# EAGLE design iBUG_4260_V1.1 (EAGLE 9.6.2)
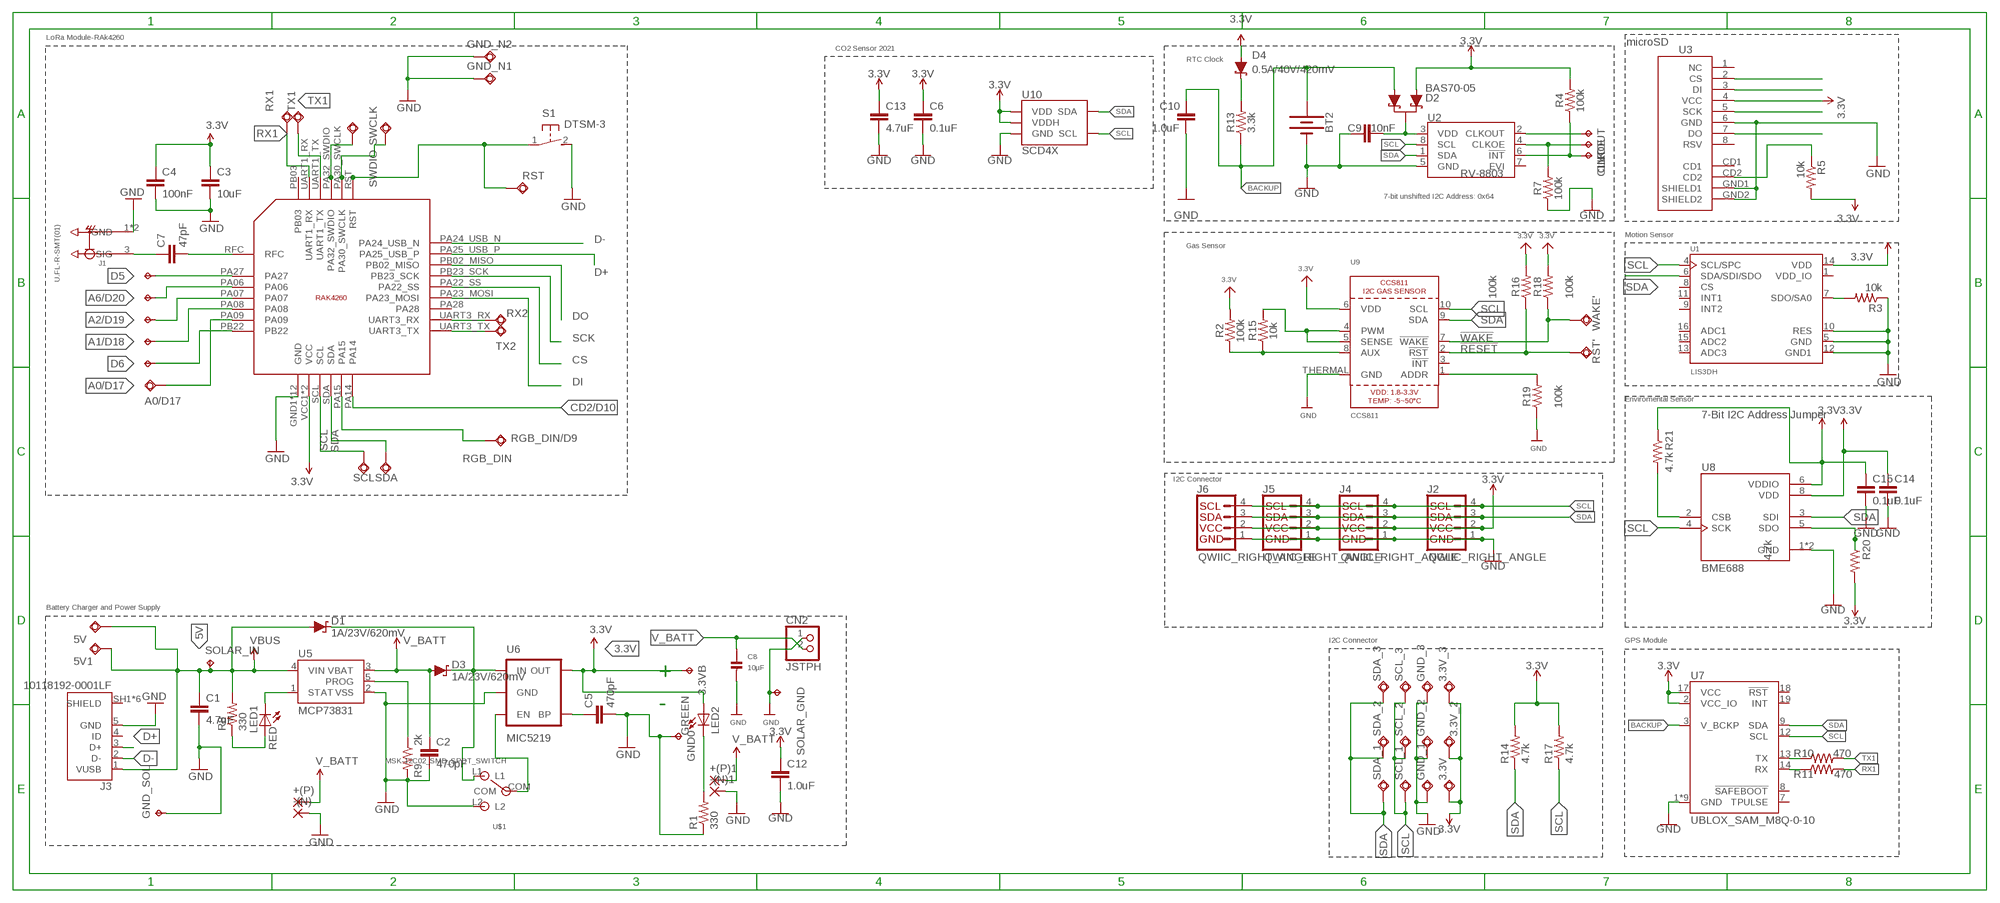
[diagram p0: schematic, sheet 1]

## Parts
3.3V  TPSQTP15R  [TP15R]
3.3V_2  TPSQTP15R  [TP15R]
3.3V_3  TPSQTP15R  [TP15R]
3.3VB  TPTP12SQ  [TP12SQ]
5V  TPSQTP19R  [TP19R]
5V1  TPSQTP19R  [TP19R]
+(P)  SMD2  [SMD1,27-2,54]
+(P)1  SMD2  [SMD1,27-2,54]
-(N)  SMD2  [SMD1,27-2,54]
-(N)1  SMD2  [SMD1,27-2,54]
A0/D17  TPSQTP15R  [TP15R]
BT2  BATTERY-12MM_SMD  [BATTCON_12MM]
C1  4.7uF  CAP0402-CAP  [0402-CAP]
C2  470pF  CAP0402-CAP  [0402-CAP]
C3  10uF  CAP0402-CAP  [0402-CAP]
C4  100nF  CAP0402-CAP  [0402-CAP]
C5  470pF  CAP0402-CAP  [0402-CAP]
C6  0.1uF  0.1UF-0603-25V-(+80/-20%)  [0603]
C7  47pF  CAP0402-CAP  [0402-CAP]
C8  10µF  CAP_CERAMIC0805  [0805]
C9  10nF  10NF-0603-50V-10%  [0603]
C10  1.0uF  1.0UF-0603-16V-10%  [0603]
C12  1.0uF  1.0UF-0603-16V-10%  [0603]
C13  4.7uF  4.7UF-0603-6.3V-(10%)  [0603]
C14  0.1uF  0.1UF-0603-100V-10%  [0603]
C15  0.1uF  0.1UF-0603-100V-10%  [0603]
CLKOE  TPTP12R  [TP12R]
CLKOUT  TPTP12R  [TP12R]
CN2  JSTPH  JST_2PIN  [JSTPH2]
D1  1A/23V/620mV  DIODE-SCHOTTKY-BAT20J  [SOD-323]
D2  BAS70-05  DIODE-SCHOTTKY-DUAL  [SOT23-3]
D3  1A/23V/620mV  DIODE-SCHOTTKY-BAT20J  [SOD-323]
D4  0.5A/40V/420mV  DIODE-SCHOTTKY-PMEG4005EJ  [SOD-323]
GND0  TPTP12SQ  [TP12SQ]
GND_1  TPSQTP15R  [TP15R]
GND_2  TPSQTP15R  [TP15R]
GND_3  TPSQTP15R  [TP15R]
GND_N1  TPSQTP19R  [TP19R]
GND_N2  TPSQTP19R  [TP19R]
GND_SOL  TPTP12SQ  [TP12SQ]
INT  TPTP12R  [TP12R]
J1  U.FL-R-SMT(01)  [HRS_U.FL-R-SMT(01)]
J2  QWIIC_RIGHT_ANGLE  QWIIC_CONNECTORJS-1MM  [JST04_1MM_RA]
J3  10118192-0001LF  [AMPHENOL_10118192-0001LF]
J4  QWIIC_RIGHT_ANGLE  QWIIC_CONNECTORJS-1MM  [JST04_1MM_RA]
J5  QWIIC_RIGHT_ANGLE  QWIIC_CONNECTORJS-1MM  [JST04_1MM_RA]
J6  QWIIC_RIGHT_ANGLE  QWIIC_CONNECTORJS-1MM  [JST04_1MM_RA]
LED1  RED  LED0603  [LED-0603@1]
LED2  GREEN  LED0603  [LED-0603@1]
P0.1  TP5P5-25-13  [P5-25-13]
R1  330  RESISTOR0402-RES  [0402-RES]
R2  100k  3.3KOHM-0603-1/10W-1%  [0603@3]
R3  10k  330OHM1/10W1%(0603)  [0603-RES]
R4  100k  100KOHM-0603-1/10W-1%  [0603@2]
R5  10k  330OHM1/10W1%(0603)  [0603-RES]
R7  100k  100KOHM-0603-1/10W-1%  [0603@2]
R8  330  RESISTOR0402-RES  [0402-RES]
R9  2k  RESISTOR0603-RES  [0603-RES]
R10  470  470OHM-0603-1/10W-1%  [0603@3]
R11  470  470OHM-0603-1/10W-1%  [0603@3]
R13  3.3k  3.3KOHM-0603-1/10W-1%  [0603@3]
R14  4.7k  RESISTOR0402-RES  [0402-RES]
R15  10k  3.3KOHM-0603-1/10W-1%  [0603@3]
R16  100k  3.3KOHM-0603-1/10W-1%  [0603@3]
R17  4.7k  RESISTOR0402-RES  [0402-RES]
R18  100k  3.3KOHM-0603-1/10W-1%  [0603@3]
R19  100k  3.3KOHM-0603-1/10W-1%  [0603@3]
R20  4.7k  4.7KOHM-0603-1/10W-1%  [0603@1]
R21  4.7k  4.7KOHM-0603-1/10W-1%  [0603@1]
RGB_DIN/D9  TPSQTP15R  [TP15R]
RST  TPSQTP19R  [TP19R]
RST'  TPSQTP15R  [TP15R]
RX1  TPSQTP15R  [TP15R]
RX2  TPSQTP15R  [TP15R]
S1  DTSM-3  [DTSM-3]
SCL  TPSQTP15R  [TP15R]
SCL_1  TPSQTP15R  [TP15R]
SCL_2  TPSQTP15R  [TP15R]
SCL_3  TPSQTP15R  [TP15R]
SDA  TPSQTP15R  [TP15R]
SDA_1  TPSQTP15R  [TP15R]
SDA_2  TPSQTP15R  [TP15R]
SDA_3  TPSQTP15R  [TP15R]
SOLAR_GND  TPTP20SQ  [TP20SQ]
SOLAR_IN  TPTP20SQ  [TP20SQ]
SWCLK  TPSQTP19R  [TP19R]
SWDIO  TPSQTP18R  [TP18R]
TX1  TPSQTP15R  [TP15R]
TX2  TPSQTP15R  [TP15R]
U1  LIS3DH  [PQFN50P300X300X100-16N]
U2  RV-8803  [RV-3028]
U3  microSD  USD-SOCKETSMD  [MICRO-SD-SOCKET-PP]
U5  MCP73831  [SOT23-5]
U6  MIC5219  V_REG_MIC52193.3V  [SOT23-5]
U7  UBLOX_SAM_M8Q-0-10  [SAM-M8Q]
U8  BME688  [IC_BME688]
U9  CCS811  [CCS811]
U10  SCD4X  [SCD4X]
U$1  MSK-12C02_SMD_SPDT_SWITCH  [MSK-12C02]
U$3  RAK4260  [RAK4260]
WAKE'  TPSQTP15R  [TP15R]

## Nets
3.3V: 3.3V.TP 3.3V_2.TP 3.3V_3.TP 3.3VB.TP C3.1 C4.1 C6.1 C12.1 C13.1 C14.1 C15.1 D2.1(A) D4.A J2.2 J4.2 J5.2 J6.2 LED2.A R2.2 R4.2 R5.2 R14.2 R16.2 R17.2 R18.2 R20.2 R21.1 U1.14(VDD) U3.4(VCC) U6.5(OUT) U7.2(VCC_IO) U7.17(VCC) U8.6(VDDIO) U8.8(VDD) U9.6(VDD) U10.7(VDD) U10.19(VDDH) U$3.VCC1(VCC) U$3.VCC2(VCC)
5V: 5V1.TP 5V.TP C1.1 D1.A J3.1(VUSB) R8.2 SOLAR_IN.TP U5.4(VIN) ; supply symbol labelled VBUS
!INT: INT.TP R4.1 U2.6(!INT)
!RESET: R16.1 RST'.TP U9.2(!RST)
!WAKE: R18.1 U9.7(!WAKE) WAKE'.TP
A0/D17: A0/D17.TP U$3.PA09
A1/D18: P0.1.TP-2 U$3.PA08
A2/D19: P0.1.TP-3 U$3.PA07
A6/D20: P0.1.TP-4 U$3.PA06
BACKUP: BT2.PWR@1(+) C10.1 D2.2(A1) R13.1 U7.3(V_BCKP)
CD1: R5.1 U3.CD2
CD2/D10: U$3.PA14
CLKOE: CLKOE.TP R7.2 U2.4(CLKOE)
CLKOUT: CLKOUT.TP U2.2(CLKOUT)
CS: U3.2(CS) U$3.PA22_SS
D5: P0.1.TP-5 U$3.PA27
D6: P0.1.TP-1 U$3.PB22
D+: J3.3(D+) U$3.PA25_USB_P
D-: J3.2(D-) U$3.PA24_USB_N
DI: U3.3(DI) U$3.PA23_MOSI
DO: U3.7(DO) U$3.PB02_MISO
GND: -(N)1.1(P) -(N).1(P) BT2.GND(-) C1.2 C2.2 C3.2 C4.2 C5.2 C6.2 C8.2 C9.1 C10.2 C12.2 C13.2 C14.2 C15.2 CN2.1 GND0.TP GND_1.TP GND_2.TP GND_3.TP GND_N1.TP GND_N2.TP GND_SOL.TP J1.1(GND) J1.2(GND) J2.1 J3.5(GND) J4.1 J5.1 J6.1 R1.1 R3.1 R7.1 R9.2 R19.1 S1.2 SOLAR_GND.TP U1.5(GND) U1.10(RES) U1.12(GND1) U2.5(GND) U3.6(GND) U3.GND1(SHIELD1) U3.GND2(SHIELD2) U5.2(VSS) U6.2(GND) U7.1(GND) U7.4(GND) U7.5(GND) U7.6(GND) U7.10(GND) U7.11(GND) U7.15(GND) U7.16(GND) U7.20(GND) U8.1(GND) U8.7(GND) U9.THERMAL(GND) U10.6(GND) U10.20(GND) U10.CP(GND) U$1.L2 U$3.GND1(GND) U$3.GND3(GND) U$3.GND10(GND) U$3.GND17(GND) U$3.GND18(GND) U$3.GND28(GND) U$3.GND35(GND) U$3.GND36(GND) U$3.GND37(GND) U$3.GND38(GND) U$3.GND39(GND) U$3.GND40(GND)
N$1: LED2.C R1.2
N$2: D1.C D3.C U6.1(IN) U$1.L1
N$3: C7.1 J1.3(SIG)
N$4: R9.1 U5.5(PROG)
N$5: U6.3(EN) U$1.COM
N$6: C7.2 U$3.RFC
N$7: C9.2 D2.3(C) U2.3(VDD)
N$8: SWDIO.TP U$3.PA32_SWDIO
N$10: R15.2 U9.4(PWM) U9.5(SENSE)
N$11: R2.1 R15.1 U9.8(AUX)
N$12: LED1.A R8.1
N$13: LED1.C U5.1(STAT)
N$14: R19.2 U9.1(ADDR)
N$15: C5.1 U6.4(BP)
N$16: RX2.TP U$3.UART3_RX
N$19: R3.2 U1.7(SDO/SA0)
N$20: SWCLK.TP U$3.PA30_SWCLK
N$22: R20.1 U8.5(SDO)
N$23: TX2.TP U$3.UART3_TX
N$24: D4.C R13.2
N$29: R21.2 U8.2(CSB)
RGB_DIN: RGB_DIN/D9.TP U$3.PA15
RST: RST.TP S1.1 U$3.RST
RX1: R11.2 RX1.TP U$3.UART1_RX
RXLV: R11.1 U7.14(RX)
SCK: U3.5(SCK) U$3.PB23_SCK
SCL: J2.4 J4.4 J5.4 J6.4 R17.1 SCL.TP SCL_1.TP SCL_2.TP SCL_3.TP U1.4(SCL/SPC) U2.8(SCL) U7.12(SCL) U8.4(SCK) U9.10(SCL) U10.9(SCL) U$3.SCL
SDA: J2.3 J4.3 J5.3 J6.3 R14.1 SDA.TP SDA_1.TP SDA_2.TP SDA_3.TP U1.6(SDA/SDI/SDO) U2.1(SDA) U7.9(SDA) U8.3(SDI) U9.9(SDA) U10.10(SDA) U$3.SDA
TX1: R10.2 TX1.TP U$3.UART1_TX
TXLV: R10.1 U7.13(TX)
V_BATT: +(P)1.1(P) +(P).1(P) C2.1 C8.1 CN2.2 D3.A U5.3(VBAT)
Unconnected: J3.4(ID) J3.SH1(SHIELD) J3.SH2(SHIELD) J3.SH3(SHIELD) J3.SH4(SHIELD) J3.SH5(SHIELD) J3.SH6(SHIELD) U1.8(CS) U1.9(INT2) U1.11(INT1) U1.13(ADC3) U1.15(ADC2) U1.16(ADC1) U2.7(EVI) U3.1(NC) U3.8(RSV) U3.CD1 U7.7(TPULSE) U7.8(!SAFEBOOT) U7.18(!RST) U7.19(INT) U9.3(!INT) U$3.PA28 U$3.PB03

## Notes on the sheet
- LoRa Module-RAk4260
- CO2 Sensor 2021
- RTC Clock
- 7-bit unshifted I2C Address: 0x64
- Motion Sensor
- Gas Sensor
- Enviromental Sensor
- 7-Bit I2C Address Jumper
- I2C Connector
- Battery Charger and Power Supply
- I2C Connector | GPS Module
- +
- -

## Power pins joined to a net without a drawn wire
VDD_IO: U1.1(VDD_IO)

## Library data of the parts
3.3V 3.3V_2 3.3V_3 A0/D17 GND_1-GND_3 RGB_DIN/D9 RST' RX1 RX2 SCL SCL_1-SCL_3 SDA SDA_1-SDA_3 TX1 TX2 WAKE' = testpad:TPSQ: Test pad
3.3VB GND0 GND_SOL SOLAR_GND SOLAR_IN = testpad:TP: Test pad; SPICEPREFIX: X
5V 5V1 GND_N1 GND_N2 RST SWCLK SWDIO = testpad:TPSQ: Test pad; SPICEPREFIX: X
+(P) +(P)1 -(N) -(N)1 = wirepad:SMD2: SMD PAD
BT2 = SparkFun-Batteries:BATTERY: Battery - Single Cell A variety of battery chemistries, sizes, and footprints. Device List: 20MM_PTH - Coin Cell Battery Holder - 20mm (PTH) <https://www.sparkfun.com/products/783> 20MM_PTH_KIT- Coin Cell battery Holder - 20 mm (PTH) <http://www.sparkfun.com/products/783>kit version with special mask 6.8MM_PTH - Coin Cell Battery Holder - 6.8MM(SMD) <https://www.digikey.com/product-detail/en/seiko-instruments/MS621FE-FL11E/728-1057-ND/1889208?WT.srch=1&gclid=CNOQ5a6LzdQCFZS2wAodXCkE0g> 12MM_SMD - Coin Cell Battery Holder - 12mm (SMD) <https://www.sparkfun.com/products/10592> 12MM_PTH - Coin Cell Battery Holder - 12mm (PTH) <https://www.sparkfun.com/products/7948> 20MM_SMD - 20mm Coin Cell Battery Holder (SMD) (2 legs) Used on the Big Time Watch Kit <https://www.sparkfun.com/products/11734> 20MM_SMD_4LEGS - Coin Cell Battery Holder - 20mm (SMD) <https://www.sparkfun.com/products/11892> 20MM_SMD_4LEGS_OVERPASTE - Coin Cell Battery Holder - 20mm (SMD) <https://www.sparkfun.com/products/11892> (Over-paste on the legs) 24.5MM_PTH - Coin Cell Battery Holder - 24.5mm (PTH) <https://www.sparkfun.com/products/8863> 9V - 9V Battery Holder - PC Mount Used on the SparkFun SparkPunk Sound Kit <https://www.sparkfun.com/products/11177> and SparkFun SparkPunk Sequencer Kit <https://www.sparkfun.com/products/12707> 18650 - Battery Holder - 18650 (PTH) <https://www.sparkfun.com/products/13113> AA - Battery Holder - 1xAA (PTH) <https://www.sparkfun.com/products/7949> AAA - Battery Holder - 1xAAA (PTH) <https://www.sparkfun.com/products/12718> AA_KIT - Battery Holder - 1xAA (PTH) <https://www.sparkfun.com/products/7949> Special kit package - pads only have exposed copper on one side of the board. AAA_KIT - Battery Holder - 1xAAA (PTH) <https://www.sparkfun.com/products/12718> Special kit package - pads only have exposed copper on one side of the board.; PROD_ID: BATT-08044; SF_SKU: PRT-10592
C1-C5 C7 = SparkFun-Passives:CAP: Capacitor Standard 0603 ceramic capacitor, and 0.1" leaded capacitor.; PROD_ID: CAP-07884
C6 = SparkFun-Capacitors:0.1UF: 0.1µF ceramic capacitors A capacitor is a passive two-terminal electrical component used to store electrical energy temporarily in an electric field.; PROD_ID: CAP-00810
C8 = microbuilder:CAP_CERAMIC: Ceramic Capacitors 0402 - 0402 Surface Mount Capacitors 16pF 50V 5% [Digikey: 445-4899-2-ND] 18pF 50V 5% [Digikey: 490-1281-2-ND] 22pF 50V 5% [Digikey: 490-1283-2-ND] 68pF 50V 5% [Digikey: 490-1289-2-ND] 0.1uF 10V 10% [Digikey: 490-1318-2-ND] 1.0uF 6.3V 10% [Digikey: 490-1320-2-ND] 0603 - 0603 Surface Mount Capacitors 16 pF 50V 5% [Digikey: 445-5051-2-ND] 22 pF 50V [Digikey: PCC220ACVTR-ND] 33 pF 50V 5% [Digikey: 490-1415-1-ND] 56pF 50V 5% [Digikey: 490-1421-1-ND] 220pF 50V 5% [Digikey: 445-1285-1-ND] 680 pF 50V 2200 pF 50V 5% C0G [Digikey: 445-1297-1-ND] 5600 pF 100V 5% X7R [Digikey: 478-3711-1-ND] 0.1 µF 25V 10% [Digikey: PCC2277TR-ND] 0.22 µF 16V 10% X7R [Digikey: 445-1318-1-ND] 1.0 µF 25V 10% [Digikey: 445-5146-2-ND] 0603 - RF Specific 3pF 250V +/-0.1pF RF [Digikey: 712-1347-1-ND] 18 pF 250V 5% [Digikey: 478-3505-1-ND or 712-1322-1-ND] 56 pF 250V 5% C0G RF [Digikey: 490-4867-1-ND] 68 pF 250V RF [Digikey: 490-4868-1-ND] 0805 - 0805 Surface Mount Capacitors 220 pF 250V 2% RF Ceramic Capacitor [Digikey: 712-1398-1-ND] 1000 pF 50V 2% NP0 Ceramic Capacitor [Digikey: 478-3760-1-ND] 0.1 µF 25V 10% Ceramic Capacitor [Digikey: PCC1828TR-ND] 1.0 µF 16V 10% Ceramic Capacitor[Digikey: 490-1691-2-ND] 10.0 µF 10V 10% Ceramic Capacitor[Digikey: 709-1228-1-ND] 10.0 uF 16V 10% Ceramic Capacitor [Digikey: 478-5165-2-ND] 47 uF 6.3V 20% Ceramic Capacitor [Digikey: 587-1779-1-ND or 399-5506-1-ND] 1206 - 1206 Surface Mount Capacitors 47uF 10V 20% Ceramic Capacitor [Digikey: 490-5528-1-ND or 399-5508-1-ND or 445-6010-1-ND] 100uF 6.3V -20%, +80% Y5V Ceramic Capacitor (Digikey: 490-4512-1-ND, Mouser: 81-GRM31CF50J107ZE1L)
C9 = SparkFun-Capacitors:10NF: 0.01uF/10nF/10,000pF ceramic capacitors A capacitor is a passive two-terminal electrical component used to store electrical energy temporarily in an electric field. CAP-09321; PROD_ID: CAP-00867
C10 C12 = SparkFun-Capacitors:1.0UF: 1µF ceramic capacitors A capacitor is a passive two-terminal electrical component used to store electrical energy temporarily in an electric field.; PROD_ID: CAP-00868
C13 = SparkFun-Capacitors:4.7UF: 4.7µF ceramic capacitors A capacitor is a passive two-terminal electrical component used to store electrical energy temporarily in an electric field.; PROD_ID: CAP-08280
C14 C15 = SparkFun-Capacitors:0.1UF: 0.1µF ceramic capacitors A capacitor is a passive two-terminal electrical component used to store electrical energy temporarily in an electric field.; PROD_ID: CAP-08390
CLKOE CLKOUT INT = testpad:TP: Test pad
CN2 = microbuilder:JST_2PIN: JST 2-Pin Right-Angle Connector PH-Series - 4UConnector: 17311 SH-Series - 4UConnector: 07278
D1 D3 = SparkFun-DiscreteSemi:DIODE-SCHOTTKY: Schottky diode A Schottky diode is a semiconductor diode which has a low forward voltage drop and a very fast switching action.; PROD_ID: DIO-11623
D2 = SparkFun-DiscreteSemi:DIODE-SCHOTTKY-DUAL: Diodes Incorporated - BAS70-05 Dual Schottky Diode Two Schottky Diodes in a single SOT-23 package. Low reverse current (100 nA) Vf: Datasheet referenced for footprint <https://www.diodes.com/assets/Datasheets/ds11007.pdf>; PROD_ID: DIO-14829
D4 = SparkFun-DiscreteSemi:DIODE-SCHOTTKY: Schottky diode A Schottky diode is a semiconductor diode which has a low forward voltage drop and a very fast switching action.; PROD_ID: DIO-10955
J1 = U.FL-R-SMT_01_:U.FL-R-SMT(01): U.FL Series 6 Ghz 50 Ohm Ultra-small SMT Coaxial Cable Receptacle Check prices <https://pricing.snapeda.com/search/part/U.FL-R-SMT%2801%29/?ref=eda>; AVAILABILITY: Warning; DESCRIPTION: U.FL (UMCC) Connector Receptacle, Male Pin 50Ohm Surface Mount Solder; MF: Hirose; MP: U.FL-R-SMT(01); PACKAGE: None; PRICE: None; PURCHASE-URL: https://pricing.snapeda.com/search/part/U.FL-R-SMT(01)/?ref=eda
J2 J4-J6 = SparkFun-Connectors:QWIIC_CONNECTOR: SparkFun I2C Standard Qwiic Connector An SMD 1mm pitch JST connector makes it easy and quick (get it? Qwiic?) to connect I2C devices to each other. The Qwiic system <http://www.sparkfun.com/qwiic> enables fast and solderless connection between popular platforms and various sensors and actuators. We carry 200mm <https://www.sparkfun.com/products/14204>, 100mm <https://www.sparkfun.com/products/14205>, 50mm <https://www.sparkfun.com/products/14206>, and breadboard friendly <https://www.sparkfun.com/products/14207> Qwiic cables. We also offer 10 pcs strips <https://www.sparkfun.com/products/14323> the SMD connectors.; PROD_ID: CONN-13694
J3 = 10118192-0001LF:10118192-0001LF: Single Port 5 Contact Horizontal Right Angle Shielded Micro B USB 2.0 Connector; AVAILABILITY: Unavailable; DESCRIPTION: USB - micro B USB 2.0 Receptacle Connector 5 Position Surface Mount, Right Angle; MF: Amphenol ICC; MP: 10118192-0001LF; PACKAGE: None; PRICE: None
LED1 LED2 = SparkFun-LED:LED: LEDs Standard schematic elements and footprints for 5mm, 3mm, 1206, and 0603 sized LEDs. 5mm - Spark Fun Electronics SKU : COM-00529 (and others); PROD_ID: DIO-00819
P0.1 = testpad:TP5: Test pad
R1 R8 R14 R17 = SparkFun-Passives:RESISTOR: Resistor Basic schematic elements and footprints for 0603, 1206, and PTH resistors.; PROD_ID: RES-00818
R2 R15 R16 R18 R19 = SparkFun-Resistors:3.3KOHM: 3.3kΩ resistor A resistor is a passive two-terminal electrical component that implements electrical resistance as a circuit element. Resistors act to reduce current flow, and, at the same time, act to lower voltage levels within circuits. - Wikipedia; PROD_ID: RES-07851; VALUE: 3.3k
R3 R5 = SparkFun-Resistors:330OHM1/10W1%(0603): RES-00818; PROD_ID: RES-00818; VALUE: 330
R4 R7 = SparkFun-Resistors:100KOHM: 100kΩ resistor A resistor is a passive two-terminal electrical component that implements electrical resistance as a circuit element. Resistors act to reduce current flow, and, at the same time, act to lower voltage levels within circuits. - Wikipedia; PROD_ID: RES-07828
R9 = SparkFun-Resistors:RESISTOR: Resistor Basic schematic elements and footprints for 0603, 1206, and PTH resistors.; PROD_ID: RES-00824
R10 R11 = SparkFun-Resistors:470OHM: 470Ω resistor A resistor is a passive two-terminal electrical component that implements electrical resistance as a circuit element. Resistors act to reduce current flow, and, at the same time, act to lower voltage levels within circuits. - Wikipedia; PROD_ID: RES-07869
R13 = SparkFun-Resistors:3.3KOHM: 3.3kΩ resistor A resistor is a passive two-terminal electrical component that implements electrical resistance as a circuit element. Resistors act to reduce current flow, and, at the same time, act to lower voltage levels within circuits. - Wikipedia; PROD_ID: RES-07851
R20 R21 = SparkFun-Resistors:4.7KOHM: 4.7kΩ resistor A resistor is a passive two-terminal electrical component that implements electrical resistance as a circuit element. Resistors act to reduce current flow, and, at the same time, act to lower voltage levels within circuits. - Wikipedia; PROD_ID: RES-07857
S1 = switch-tact:DTSM-3
U1 = LIS3DH (1):LIS3DH: MEMS digital output motion sensor ultra low-power high performance 3-axes "nano" accelerometer Check prices <https://pricing.snapeda.com/parts/LIS3DH/STMicroelectronics/view-part?ref=eda>; AVAILABILITY: Bad; DESCRIPTION: Accelerometer X, Y, Z Axis ±2g, 4g, 8g, 16g 0.5Hz ~ 625Hz 16-LGA (3x3); MF: STMicroelectronics; MP: LIS3DH; PACKAGE: LGA-16 STMicroelectronics; PRICE: None
U2 = SparkFun-Clocks:RV-8803: Micro Crystal RV-8803 - Temperature compensated RTC Ultra accurate plus/minus 3PPM I2C RTC. Temperature compensated crystal for low drift; PROD_ID: IC-14828
U3 = SparkFun:USD-SOCKET: microSD Socket Push-push type uSD socket. Schematic element and footprint production proven. Spark Fun Electronics SKU : PRT-00127. tDoc lines correctly indicate media card edge positions when inserting (unlocked, locked, depressed).
U5 = SparkFun-PowerIC:MCP73831: Miniature single cell, fully integrated Li-Ion, Li-polymer charge management controller http://ww1.microchip.com/downloads/en/DeviceDoc/21984a.pdf IC-09995; PROD_ID: IC-09995
U6 = SparkFun-PowerIC:V_REG_MIC5219: V_REG MIC5219 Standard 3.3V and 5V 500mA LDO voltage regulator in SOT-23 layout. Micrel part MIC5219. BP (by-pass) pin is used to lower output noise with 470pF cap, may be left open.; PROD_ID: VREG-09872; VALUE: MIC5219 3.3V
U7 = SparkFun-GPS:UBLOX_SAM_M8Q-0-10: u-blox SAM-M8Q The u-blox concurrent SAM-M8Q GNSS patch antenna module benefits from the exceptional performance of the u-blox M8 multi-GNSS engine. The SAM-M8Q module offers high sensitivity and minimal acquisition times in an ultra compact form factor. The SAM-M8Q module utilizes concurrent reception of up to three GNSS systems (GPS/Galileo and GLONASS), recognizes multiple constellations simultaneously and provides outstanding positioning accuracy in scenarios where urban canyon or weak signals are involved. For even better and faster positioning improvement, the SAM-M8Q supports augmentation of QZSS, GAGAN and IMES together with WAAS, EGNOS, MSAS. The SAM-M8Q also supports message integrity protection, geofencing, and spoofing detection with configurable interface settings to easily fit to customer applications.; PROD_ID: IC-14070
U8 = BME688:BME688: Gas sensor measuring relative humidity, barometric pressure, ambient temperature and gas (VOC) Check prices <https://pricing.snapeda.com/parts/BME688/Bosch%20Sensortec/view-part?ref=eda>; AVAILABILITY: In Stock; DESCRIPTION: Gas sensor measuring relative humidity, barometric pressure, ambient temperature and gas (VOC); MF: Bosch Sensortec; MP: BME688; PACKAGE: None; PRICE: None; PURCHASE-URL: https://pricing.snapeda.com/search/part/BME688/?ref=eda
U9 = microbuilder:CCS811: CCS811 - I2C Gas and Air Quality Sensor
U10 = NewParts:SCD4X: The SGP40 is a digital gas sensor designed for easy integration into air purifiers or demand-controlled ventilation systems.
U$1 = MSK-12C02 SMD Micro Slider Switch SPDT:MSK-12C02_SMD_SPDT_SWITCH: Footprint of the VIMEX MSK-12C02 SPDT SMD Switch Created by mzst on 17-Jan-2016
U$3 = RAK4260:RAK4260: RAK4260 LoRaWAN module from RAKwireless.

## Net classes
1 power: width 0.254 mm
2 3.3V: width 0.305 mm

## Board
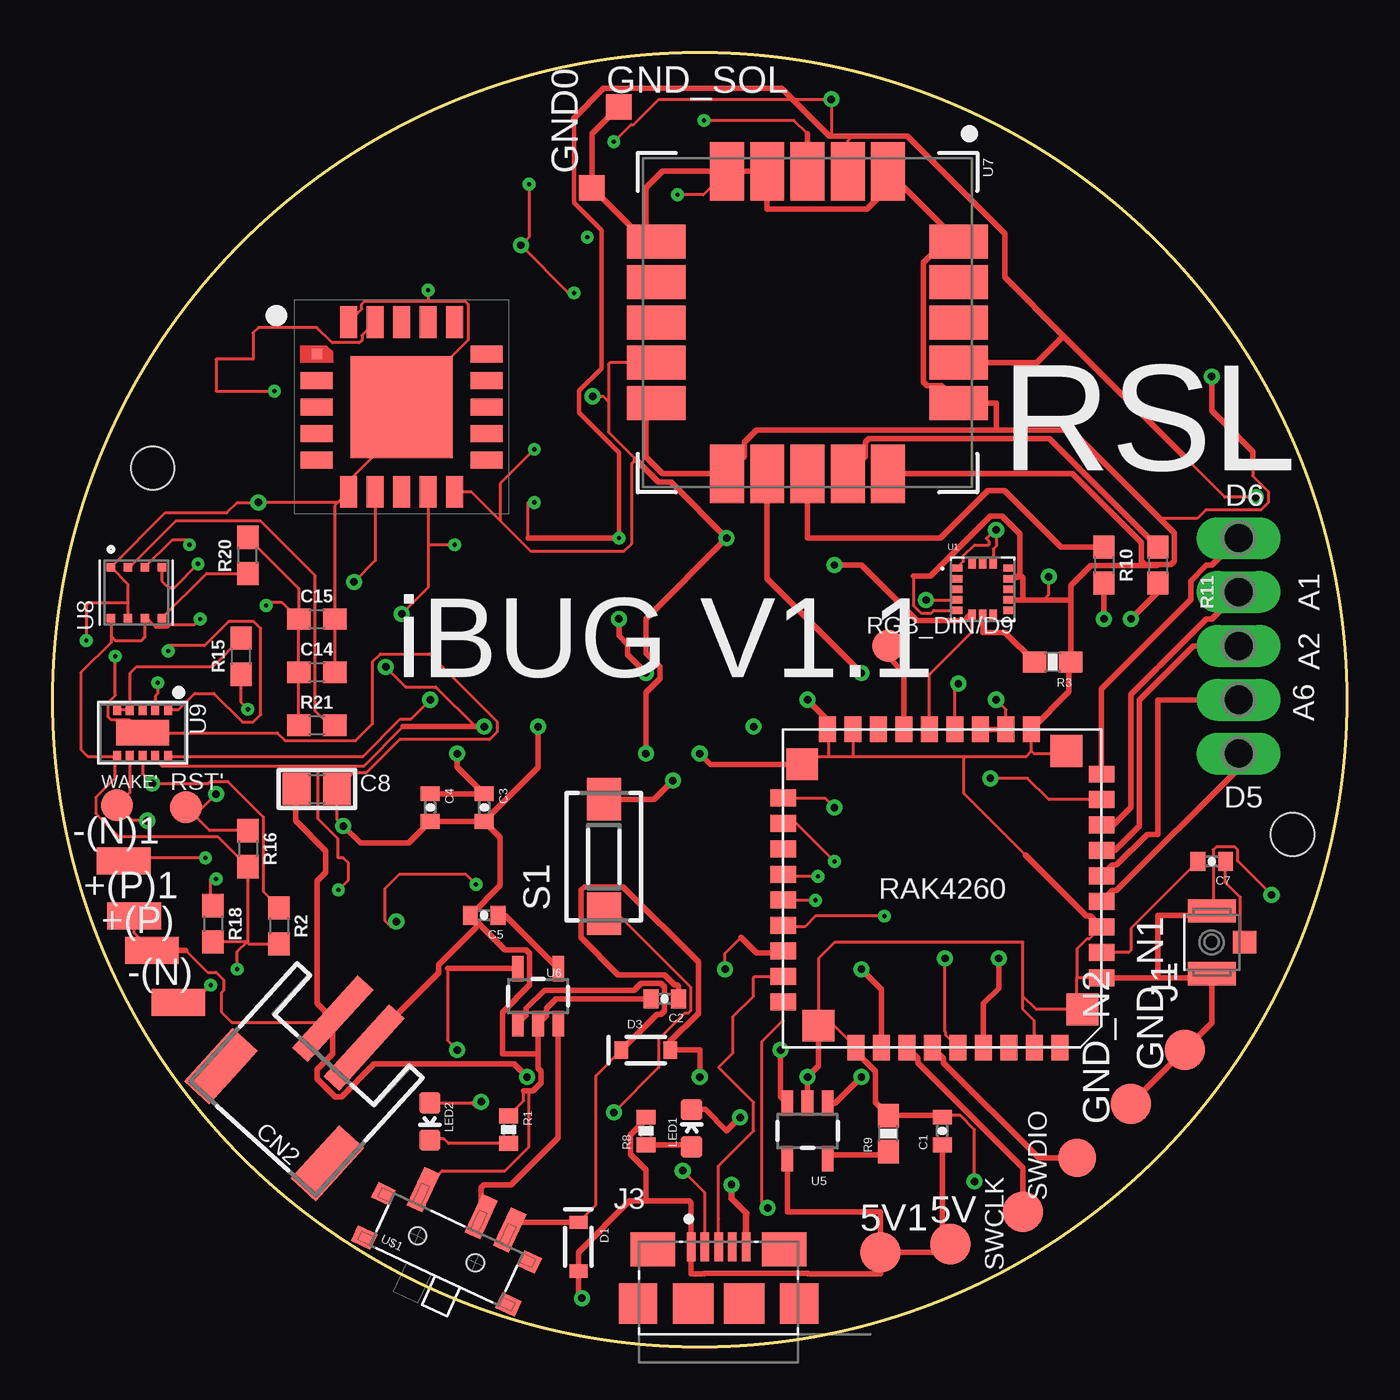
[diagram p1: board, top side]
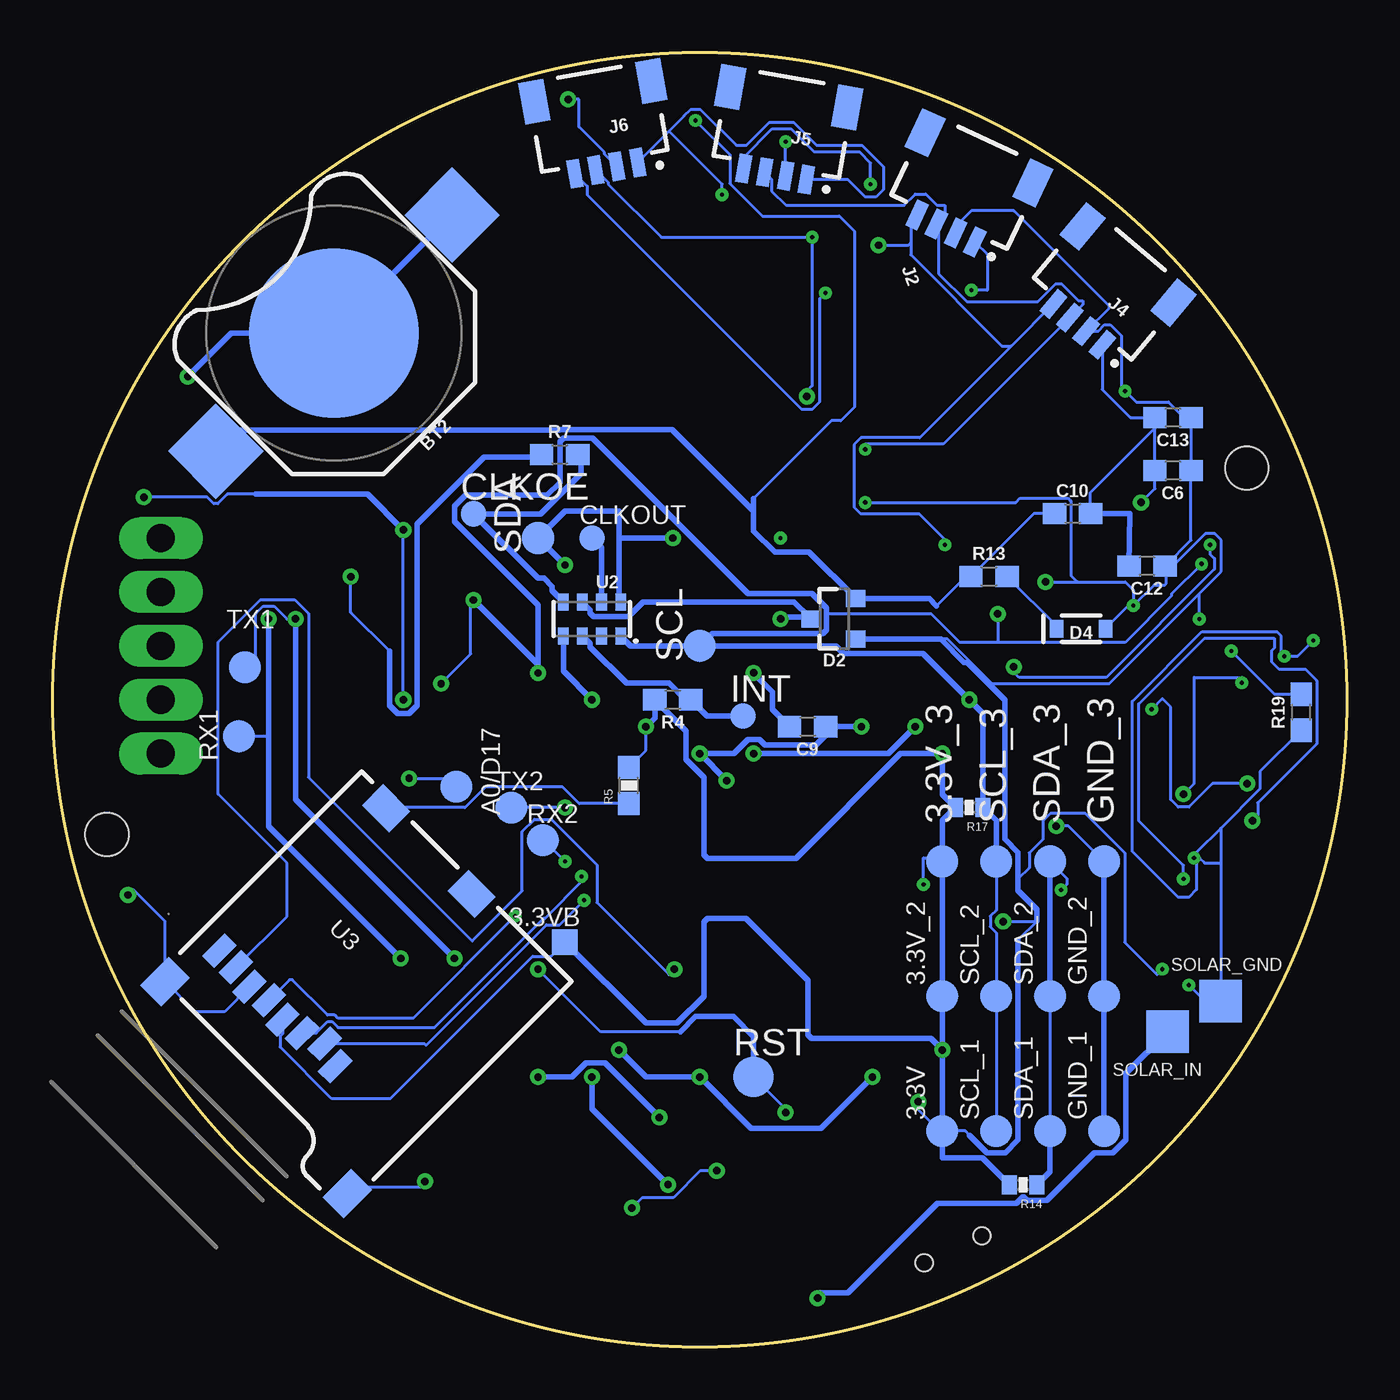
[diagram p2: board, bottom side, seen from below]

Size 60.96 x 60.96 mm. Coordinates in mm from the lower left corner, seen from the top.
Outline: circle at 30.48,30.48 radius 30.48
Copper layers (1*16): Top 0.035mm / dielectric 1.5mm / Bottom 0.035mm
Design rules "default": minimum track width 6mil, minimum drill 0.35mm, track to track 6mil, track to pad 6mil, pad to pad 6mil, via to via 6mil, smd to smd 6mil, copper to edge 40mil, drill to drill 6mil, minimum pad ring 10mil, minimum via ring 8mil, stop-mask expansion 4mil, vias tented up to drill 0mil, thermal gap 10mil
Holes 2.03 mm at 4.7,41.4 58.42,24.13

### Footprints (pad centres in the part's own frame; a part is rotated, then mirrored left to right if it is on the bottom)
TP15R = smd 1.5 x 1.5: TP 0,0
TP12SQ = smd 1.2 x 1.2: TP 0,0
TP19R = smd 1.9 x 1.9: TP 0,0
SMD1,27-2,54 = smd 1.27 x 2.54: 1 0,0
BATTCON_12MM = smd 8 x 8: GND 0,0 | smd 3.175 x 3.175: PWR@1 -7.874,0; PWR@2 7.874,0
0402-CAP = smd 0.7 x 0.9: 1 -0.65,0; 2 0.65,0
0603 = smd 1.1 x 1: 1 -0.85,0; 2 0.85,0
0805 = smd 1.3 x 1.5: 1 -0.95,0; 2 0.95,0
TP12R = smd 1.2 x 1.2: TP 0,0
JSTPH2 = smd 1 x 4.6: 1 -1,-3.7; 2 1,-3.7 | smd 1.6 x 3.4: NC1 -3.4,1.5; NC2 3.4,1.5
SOD-323 = smd 0.63 x 0.83: A 1.15,0; C -1.15,0
SOT23-3 = smd 0.8 x 0.9: 1 -0.95,-1; 2 0.95,-1; 3 0,1.1
HRS_U.FL-R-SMT(01) = smd 1.1 x 2.25: 1 -1.475,0; 2 1.475,0 | smd 1.05 x 1.1: 3 0,-1.55
JST04_1MM_RA = smd 0.6 x 1.35: 1 -1.5,0; 2 -0.5,0; 3 0.5,0; 4 1.5,0 | smd 1.2 x 2: NC1 2.8,-3.675; NC2 -2.8,-3.675
AMPHENOL_10118192-0001LF = smd 0.4 x 1.35: 1 -1.3,0; 2 -0.65,0; 3 0,0; 4 0.65,0; 5 1.3,0 | smd 2.1 x 1.6: SH1 -3.1,-0.125; SH2 3.1,-0.125 | smd 1.8 x 1.9: SH3 -3.8,-2.675; SH6 3.8,-2.675 | smd 1.9 x 1.9: SH4 -1.2,-2.675; SH5 1.2,-2.675
LED-0603@1 = smd 1 x 1: A 0,-0.877; C 0,0.877
P5-25-13 = drill 1.321 pad 1.905 long: TP-1 -5.08,0; TP-2 -2.54,0; TP-3 0,0; TP-4 2.54,0; TP-5 5.08,0
0402-RES = smd 0.7 x 0.9: 1 -0.65,0; 2 0.65,0
0603@3 = smd 1.1 x 1: 1 -0.85,0; 2 0.85,0
0603-RES = smd 1.1 x 1: 1 -0.85,0; 2 0.85,0
0603@2 = smd 1.1 x 1: 1 -0.85,0; 2 0.85,0
0603@1 = smd 1.1 x 1: 1 -0.85,0; 2 0.85,0
DTSM-3 = smd 2 x 1.6: 1 -2.7,0; 2 2.7,0
TP20SQ = smd 2 x 2: TP 0,0
TP18R = smd 1.8 x 1.8: TP 0,0
PQFN50P300X300X100-16N = smd 0.52 x 0.35: 1 -1.225,1; 2 -1.225,0.5; 3 -1.225,0; 4 -1.225,-0.5; 5 -1.225,-1; 9 1.225,-1; 10 1.225,-0.5; 11 1.225,0; 12 1.225,0.5; 13 1.225,1 | smd 0.35 x 0.52: 6 -0.5,-1.225; 7 0,-1.225; 8 0.5,-1.225; 14 0.5,1.225; 15 0,1.225; 16 -0.5,1.225
RV-3028 = smd 0.5 x 0.8: 1 -1.35,-0.8; 2 -0.45,-0.8; 3 0.45,-0.8; 4 1.35,-0.8; 5 1.35,0.8; 6 0.45,0.8; 7 -0.45,0.8; 8 -1.35,0.8
MICRO-SD-SOCKET-PP = smd 0.8 x 1.5: 1 -8.94,10.7; 2 -7.84,10.3; 3 -6.74,10.7; 4 -5.64,10.9; 5 -4.54,10.7; 6 -3.44,10.9; 7 -2.34,10.7; 8 -1.24,10.7 | smd 1.8 x 1.4: CD1 -7.75,0.4; CD2 -2.05,0.4 | smd 1.4 x 1.9: GND1 -13.6,14.55; GND2 -0.45,13.55
SOT23-5 = smd 0.55 x 1.2: 1 -0.95,-1.3; 2 0,-1.3; 3 0.95,-1.3; 4 0.95,1.3; 5 -0.95,1.3
SAM-M8Q = smd 2.75 x 1.6: 1 -7.125,3.8; 2 -7.125,1.9; 3 -7.125,0; 4 -7.125,-1.9; 5 -7.125,-3.8; 11 7.125,-3.8; 12 7.125,-1.9; 13 7.125,0; 14 7.125,1.9; 15 7.125,3.8 | smd 1.6 x 2.75: 6 -3.8,-7.125; 7 -1.9,-7.125; 8 0,-7.125; 9 1.9,-7.125; 10 3.8,-7.125; 16 3.8,7.125; 17 1.9,7.125; 18 0,7.125; 19 -1.9,7.125; 20 -3.8,7.125
IC_BME688 = smd 0.4 x 0.4: 1 1.2,1.2; 2 1.2,0.4; 3 1.2,-0.4; 4 1.2,-1.2; 5 -1.2,-1.2; 6 -1.2,-0.4; 7 -1.2,0.4; 8 -1.2,1.2
CCS811 = smd 0.5 x 0.375: 1 -1.1,1.2; 2 -1.1,0.6; 3 -1.1,0; 4 -1.1,-0.6; 5 -1.1,-1.2; 6 1.1,-1.2; 7 1.1,-0.6; 8 1.1,0; 9 1.1,0.6; 10 1.1,1.2 | smd 1.2 x 2.5: THERMAL 0,0
SCD4X = smd 0.5 x 0.5: 1 -4,2.5 | smd 1.5 x 0.8: 2 -4,1.25; 3 -4,0; 4 -4,-1.25; 5 -4,-2.5; 11 4,-2.5; 12 4,-1.25; 13 4,0; 14 4,1.25; 15 4,2.5 | smd 0.8 x 1.5: 6 -2.5,-4; 7 -1.25,-4; 8 0,-4; 9 1.25,-4; 10 2.5,-4; 16 2.5,4; 17 1.25,4; 18 0,4; 19 -1.25,4; 20 -2.5,4 | smd 4.8 x 4.8: CP 0,0
MSK-12C02 = smd 0.8 x 2: COM 0.823,2.1; L1 2.323,2.1; L2 -2.177,2.1 | smd 1 x 0.8: GND@1 -3.75,-1.125; GND@4 3.75,-1.125 | smd 0.9 x 0.8: GND@2 -3.8,1.125; GND@3 3.8,1.125 | hole 0.8: -1.5,0; 1.5,0
RAK4260 = smd 1.2 x 0.8: GND1 -7.5,4.22; GND3 -7.5,1.82; PA06 -7.5,-0.58; PA07 -7.5,-1.78; PA08 -7.5,-2.98; PA09 -7.5,-4.18; PA22_SS 7.5,0.55; PA23_MOSI 7.5,-0.65; PA24_USB_N 7.5,5.35; PA25_USB_P 7.5,4.15; PA27 -7.5,0.62; PA28 7.5,-1.85; PB02_MISO 7.5,2.95; PB22 -7.5,-5.38; PB23_SCK 7.5,1.75; RFC -7.5,3.02; UART3_RX 7.5,-3.05; UART3_TX 7.5,-4.25 | smd 0.8 x 1.2: GND10 -4.2,-7.5; GND17 4.2,-7.5; GND18 5.4,-7.5; GND28 4.06,7.5; GND35 -4.34,7.5; GND36 -5.54,7.5; PA14 3,-7.5; PA15 1.8,-7.5; PA30_SWCLK 1.66,7.5; PA32_SWDIO 0.46,7.5; PB03 -3.14,7.5; RST 2.86,7.5; SCL -0.6,-7.5; SDA 0.6,-7.5; UART1_RX -1.94,7.5; UART1_TX -0.74,7.5; VCC1 -3,-7.5; VCC2 -1.8,-7.5 | smd 1.5 x 1.5: GND37 -5.85,-6.48; GND38 6.6,-5.85; GND39 5.83,6.47; GND40 -6.61,5.71

### Placement (x,y rotation side)
3.3V  19.05,10.16 90 bottom
3.3V_2  19.05,16.51 90 bottom
3.3V_3  19.05,22.86 90 bottom
3.3VB  36.83,19.05 90 bottom
5V  42.29,4.83 0 top
5V1  38.99,4.44 0 top
+(P)  4.66,18.66 270 top
+(P)1  3.83,20.3 270 top
-(N)  5.91,16.22 270 top
-(N)1  3.33,22.88 270 top
A0/D17  41.95,26.38 0 bottom
BT2  47.72,47.76 45 bottom
C1  41.91,10.16 90 top
C2  28.83,16.38 180 top
C3  20.32,25.4 270 top
C4  17.78,25.4 270 top
C5  20.32,20.32 180 top
C6  8.18,41.28 180 bottom
C7  54.61,22.86 180 top
C8  12.43,26.28 0 top
C9  25.4,29.21 180 bottom
C10  12.91,39.25 0 bottom
C12  9.4,36.78 180 bottom
C13  8.18,43.78 180 bottom
C14  12.43,31.78 0 top
C15  12.43,34.28 0 top
CLKOE  41.15,39.24 0 bottom
CLKOUT  35.56,38.1 0 bottom
CN2  11.43,12.03 137.7 top
D1  24.77,4.7 270 top
D2  24.13,34.29 90 bottom
D3  27.94,13.97 0 top
D4  12.51,33.83 0 bottom
GND0  25.4,54.61 0 top
GND_1  11.43,10.16 90 bottom
GND_2  11.43,16.51 90 bottom
GND_3  11.43,22.86 0 bottom
GND_N1  53.34,13.97 90 top
GND_N2  50.8,11.43 90 top
GND_SOL  26.67,58.42 0 top
INT  28.45,29.72 0 bottom
J1  54.61,19.05 90 top
J2  18.87,52.69 155 bottom
J3  31.37,4.7 0 top
J4  12.66,48.17 140 bottom
J5  26.93,55.26 170 bottom
J6  34.89,55.53 190 bottom
LED1  30.1,10.29 0 top
LED2  17.76,10.6 180 top
P0.1  55.88,33.02 270 top
R1  21.47,10.22 270 top
R2  10.64,19.82 270 top
R3  47.12,32.26 180 top
R4  31.75,30.48 180 bottom
R5  33.82,26.44 90 bottom
R7  37.08,42.04 0 bottom
R8  27.94,10.16 90 top
R9  39.37,10.03 90 top
R10  49.53,36.83 270 top
R11  52.07,36.83 270 top
R13  16.85,36.29 0 bottom
R14  15.24,7.62 180 bottom
R15  8.87,32.54 90 top
R16  9.18,23.47 270 top
R17  17.78,25.4 180 bottom
R18  7.54,19.92 270 top
R19  2.13,29.89 90 bottom
R20  9.18,37.28 90 top
R21  12.43,29.28 0 top
RGB_DIN/D9  39.37,33.02 0 top
RST  27.94,12.7 0 bottom
RST'  6.27,25.42 0 top
RX1  52.2,28.76 0 bottom
RX2  37.87,23.86 0 bottom
S1  25.96,23.09 90 top
SCL  30.48,33.02 90 bottom
SCL_1  16.51,10.16 90 bottom
SCL_2  16.51,16.51 0 bottom
SCL_3  16.51,22.86 90 bottom
SDA  38.1,38.1 90 bottom
SDA_1  13.97,10.16 90 bottom
SDA_2  13.97,16.51 90 bottom
SDA_3  13.97,22.86 0 bottom
SOLAR_GND  5.93,16.28 0 bottom
SOLAR_IN  8.43,14.83 0 bottom
SWCLK  45.72,6.35 0 top
SWDIO  48.26,8.89 0 top
TX1  51.91,32.01 0 bottom
TX2  39.37,25.4 0 bottom
U1  43.82,35.69 0 top
U2  35.56,34.29 180 bottom
U3  46.42,27.1 135 bottom
U5  35.56,10.16 180 top
U6  22.86,16.51 0 top
U7  35.56,48.26 270 top
U8  3.93,35.53 90 top
U9  4.22,28.91 270 top
U10  16.43,44.28 0 top
U$1  18.54,4.57 335 top
U$3  41.91,21.59 180 top
WAKE'  3.02,25.5 0 top

### Tracks (layer width: path | path; a pad name or v marks a point on that pad's centre or on a via)
3.3V  (via drill 0.2, 0.35)
  Top 0.152: U$3.VCC1 44.91,30.02 v44.45,30.48 | v44.45,38.48 44.45,37.72 44.32,37.58 U1.14 | v19.93,21.78 19.46,22.25 16.32,22.25 15.64,21.57 15.64,20.07 15.93,19.78 v16.18,20.03 | U7.2 37.46,56.82 37.68,57.04 | R20.2 11.58,35.73 C15.1 | U9.6 2.93,27.81 | 2.93,27.81 1.65,27.81 1.31,28.15 1.31,31.77 2.73,33.19 U8.8 2.73,33.48 2.93,33.28 4.18,33.28 4.33,33.43 U8.6 4.41,34.33 4.84,33.9 5.43,33.9 5.55,34.03 6.68,34.03 v6.93,34.28 | R21.1 C14.1 C15.1 | 18.58,17.81 18.58,14.44 v19.05,13.97 | LED2.A 19.73,11.48 19.93,11.28 v20.18,11.53 | 9.18,19.03 R16.2 7.79,24.01 3.13,24.01 2.04,25.09 2.04,25.9 2.93,26.79 2.93,27.81 | 9.18,19.03 9.24,18.97 R2.2 | 9.18,19.03 9.14,19.07 | 9.14,19.07 R18.2 | U10.19 14.56,47.66 14.56,47.44 14.43,47.3 13.16,47.3 12.43,48.03 9.68,48.03 9.43,47.78 9.43,46.53 7.68,46.53 7.68,45.03 v10.43,45.03 | U10.7 15.18,37.03 v14.18,36.03 | 22.4,38.1 22.4,39.78 v22.68,39.78 | v8.68,17.78 8.68,18.61 9.14,19.07 | v10.04,34.92 10.18,35.06 10.8,35.06 C15.1 | v56.68,40.03 55.22,40.03 53.34,41.91 | 36.68,57.04 v36.68,58.78 28.55,58.78 27.37,57.59 27.24,57.59 v26.43,56.78
  Top 0.203: v26.67,38.1 26.67,42.14 24.8,44.01 24.8,45.04 25.85,46.09 25.85,52.6 24.55,53.91 24.55,57.84 24.52,57.87
  Top 0.254: U6.5 18.58,17.81 | C4.1 C3.1 19.05,27.32 v19.05,27.94 | 47.62,47.62 44.86,50.39 44.86,52.46 40.28,57.04 37.68,57.04 36.68,57.04 36.6,57.04 34.34,59.3 25.95,59.3 24.52,57.87 | 47.62,47.62 46.36,46.36 46.35,46.36 U7.17 | v26.67,38.1 22.4,38.1 | U$3.VCC1 U$3.VCC2 | 53.34,41.91 47.62,47.62
  Bottom 0.152: v44.45,30.48 v44.45,38.48 | v19.93,21.78 19.93,23.03 19.05,23.03 | 3.3VB.TP 37.49,18.39 38.35,18.39 45.07,11.67 47.82,11.67 50.26,14.11 50.26,14.61 50.14,14.74 U3.4 | R5.2 33.02,28.09 v33.02,29.21 | 8.49,36.84 C12.1 8.18,36.78 6.65,38.31 6.21,38.31 5.9,38 5.9,36.52 6.93,35.49 | 8.49,36.84 7.33,38 C6.1 C13.1 7.66,43.78 8.39,44.51 9.91,44.51 v10.43,45.03 10.61,45.21 10.61,47.63 11.13,48.16 11.4,48.16 11.7,47.85 J4.2 11.18,48.95 11.18,49.03 15.68,53.53 17.68,53.53 18.42,52.79 J2.2 | 14.6,20.03 15.48,19.15 | 17.76,9.95 17.97,10.16 3.3V.TP | v20.18,11.53 20.18,11.16 19.05,10.03 | v14.18,36.03 12.68,36.03 | 12.68,36.03 10.43,36.03 10.04,35.64 v10.04,34.92 | D2.1 18.8,33.34 16.69,31.22 11.2,31.22 6.93,35.49 | v22.68,39.78 15.58,39.78 15.39,39.98 13.12,39.98 12.98,39.84 12.98,36.33 12.68,36.03 | v16.18,20.03 14.6,20.03 | 14.58,20.05 14.6,20.03 | v8.68,17.78 8.93,17.53 10.45,19.05 10.45,23.26 12.32,25.14 13.93,25.14 14.29,24.78 14.29,23.93 14.95,23.26 14.95,22.56 15.48,22.03 | v6.93,34.28 6.93,35.49 | v10.04,34.92 10.27,34.92 D4.A | v10.04,34.92 9.06,35.9 8.55,35.9 8.49,35.96 8.49,36.84 | 51.4,40.17 52.74,40.17 53.19,39.72 53.38,39.72 53.69,40.03 v56.68,40.03 | J6.2 34.98,56.2 34.98,56.28 36.18,57.48 36.18,58.78 v36.68,58.78 | J5.2 v26.43,56.78
  Bottom 0.254: v19.05,13.97 3.3V_2.TP 3.3V_3.TP 19.05,23.03 19.05,24.78 R17.2 19.05,26.02 v19.05,27.94 21.02,27.94 25.95,23.01 30.13,23.01 30.29,23.17 30.29,26.82 31.14,27.67 31.14,29.02 R4.2 32.6,29.63 v33.02,29.21 | v19.05,13.97 3.3V.TP 19.05,10.03 19.05,8.89 17.16,8.89 R14.2 | v44.45,38.48 46.14,40.17 51.4,40.17 | v19.05,13.97 19.59,14.51 25.22,14.51 25.38,14.67 25.38,17.25 28.29,20.17 30.13,20.17 30.29,20.01 30.29,16.51 31.56,15.24 33.02,15.24 3.3VB.TP | 14.58,20.05 14.58,20.59 15.48,21.49 15.48,22.03 15.48,23.29 16.1,23.91 16.1,30.48 17.86,32.24 18.03,32.24 19.13,33.34 D2.1 | 17.76,9.95 16.94,9.13 16.08,9.13 15.48,9.73 15.48,19.15
5V  (via drill 0.35)
  Top 0.254: 27.94,6.86 29.97,6.86 30.07,6.76 J3.1 30.07,3.43 30.71,3.43 30.71,3.44 35.58,3.44 35.58,3.43 38.99,3.43 5V1.TP | 27.94,6.86 27.18,6.86 24.77,4.44 D1.A 24.77,2.44 v24.93,2.28 | 27.94,6.86 27.94,8.31 27.21,9.04 27.21,9.98 27.94,10.7 R8.2 | 5V1.TP 41.91,4.44 5V.TP 41.91,5.21 C1.1 | 5V1.TP 38.99,6.35 34.61,6.35 U5.4
  Bottom 0.254: SOLAR_IN.TP 10.4,12.86 10.4,9.73 11,9.13 11.88,9.13 14.12,6.89 15.06,6.89 15.22,7.05 15.26,7.05 15.57,6.75 19.27,6.75 23.49,2.53 24.93,2.53 v24.93,2.28
!INT
  Bottom 0.254: U2.6 35.64,33.12 35.64,32.97 33.92,31.26 31.93,31.26 31.16,30.48 R4.1 30.14,29.72 INT.TP
!RESET  (via drill 0.2, 0.35)
  Top 0.152: RST'.TP 6.3,25.39 | 6.3,25.39 7.38,24.31 R16.1 | v4.93,31.28 4.93,30.76 4.82,30.65 U9.2 | v7.68,26.03 7.05,25.39 6.3,25.39
  Bottom 0.152: v7.68,26.03 7.18,26.53 7.18,31.53 4.93,31.53 v4.93,31.28
!WAKE  (via drill 0.2, 0.35)
  Top 0.152: U9.7 3.62,26.1 WAKE'.TP 3.74,24.78 v4.43,24.78 | R18.1 7.43,20.88 7.43,22.03 v7.68,22.03
  Bottom 0.152: v7.68,22.03 7.68,22.67 9.79,24.78 9.79,30.28 6.68,33.39 3.4,33.39 3.4,32.91 3.54,32.78 3.54,32.28 3.18,31.92 1.94,31.92 1.4,31.38 1.4,28.39 4.18,25.62 4.18,25.03 v4.43,24.78
A0/D17  (via drill 0.35)
  Top 0.152: U$3.PA09 46.94,25.77 45.93,26.78 v44.18,26.78
  Bottom 0.152: v44.18,26.78 42.35,26.78 A0/D17.TP
A1/D18
  Top 0.152: 52.14,32.07 52.02,31.94
  Top 0.254: U$3.PA08 49.97,24.57 50.8,25.4 50.8,30.73 52.02,31.94 | P0.1.TP-2 54.61,34.29 54.36,34.29 52.14,32.07
A2/D19
  Top 0.254: U$3.PA07 50.04,23.37 51.21,24.54 51.21,30.48 53.75,33.02 P0.1.TP-3
A6/D20
  Top 0.254: U$3.PA06 49.93,22.69 50.13,22.69 51.57,24.13 52.07,24.13 52.07,30.48 P0.1.TP-4
BACKUP  (via drill 0.2)
  Top 0.152: 35.56,57.15 34.93,57.78 v30.68,57.78
  Top 0.254: U7.3 35.56,57.15
  Bottom 0.152: 19.32,34.9 17.94,36.29 R13.1 14.74,39.25 C10.1 | v30.68,57.78 29.06,56.16 29.06,54.81 27.54,53.28 23.9,53.28 23.18,52.56 23.18,44.28 23.83,43.63 24.28,43.63 27.94,39.97
  Bottom 0.254: BT2.PWR@1 52.3,43.18 37.11,43.18 37.07,43.22 31.79,43.22 27.94,39.37 | 19.32,34.9 19.66,35.24 D2.2 25.33,37.44 26.94,37.44 27.94,38.44 27.94,39.37 | 27.94,39.37 27.94,39.78 27.94,39.97
CD1
  Bottom 0.152: R5.1 36.16,25.59 36.95,26.38 40.57,26.38 41.55,25.4 45.22,25.4 U3.CD2
CLKOE
  Bottom 0.254: U2.4 37.44,35.62 37.44,35.82 37.83,36.21 38.11,36.21 CLKOE.TP 37.97,39.24 36.07,41.15 36.07,41.87 R7.2
CLKOUT
  Bottom 0.254: U2.2 35.11,37.65 CLKOUT.TP
CS  (via drill 0.2)
  Top 0.152: v35.93,21.03 U$3.PA22_SS
  Bottom 0.152: v35.93,21.03 37.08,19.88 37.71,19.88 43.39,14.2 43.46,14.27 U3.2
D5
  Top 0.254: U$3.PA27 49.93,21.49 50.13,21.49 55.88,27.25 P0.1.TP-5
D6
  Top 0.254: P0.1.TP-1 54.61,36.83 54.36,36.83 53.62,36.09 53.62,35.19 49.41,30.99 U$3.PB22
D+
  Top 0.152: U$3.PA25_USB_P 33.06,17.44 33.02,17.4 33.02,16.51 32.06,15.54 32.06,13.84 31.37,13.16 33.02,11.51 33.02,10.16 31.37,8.51 31.37,6.03 J3.3
D-  (via drill 0.35)
  Top 0.152: U$3.PA24_USB_N 34.41,15.36 33.4,14.35 33.4,6.81 v33.68,6.53 | J3.2 30.72,7.24 v29.68,8.28
  Bottom 0.152: v33.68,6.53 33.2,7.01 31.72,7.01 30.46,8.28 v29.68,8.28
DI  (via drill 0.2)
  Top 0.152: v36.06,22.15 34.5,22.15 U$3.PA23_MOSI
  Bottom 0.152: v36.06,22.15 35.93,22.03 37.78,20.18 37.83,20.18 42.99,15.03 46.93,15.03 47.53,15.03 47.82,15.31 48.01,15.31 48.55,14.77 U3.3
DO  (via drill 0.35)
  Top 0.152: v31.68,17.78 31.68,18.53 32.42,19.27
  Top 0.254: 32.42,19.27 33.15,18.54 34.31,18.54 U$3.PB02_MISO
  Bottom 0.152: v31.68,17.78 31.93,17.53 35.32,20.92 35.32,22.7 37.47,24.84 38.28,24.84 38.85,24.26 38.85,21.47 41.21,19.11 48.92,26.82 48.92,34.54 49.58,35.2 51.18,35.2 53.18,33.2 53.18,26.03 49.93,22.79 49.93,20.28 U3.7
GND  (via drill 0.2, 0.35)
  Top 0.152: 41.84,10.88 C1.2 | U$3.GND28 36.82,15.12 U$3.GND39 36.08,18.3 36.83,19.05 45.72,19.05 45.72,16.51 | 45.72,16.51 45.72,15.87 46.25,15.34 U$3.GND35 U$3.GND36 | 45.72,16.51 46.35,15.88 U$3.GND40 48.26,16.14 48.26,17.4 | 48.26,17.4 49.38,17.4 U$3.GND1 52.07,17.37 54.41,17.37 J1.1 | U$3.GND3 48.84,19.2 48.72,19.2 48.26,18.74 48.26,17.4 | 46.11,28.06 46.23,27.94 47.63,27.94 U$3.GND37 | 46.11,28.06 U$3.GND10 | U$3.GND38 35.68,27.81 36.58,27.81 | 36.58,27.81 36.58,29.02 U$3.GND18 | 36.58,27.81 37.72,27.81 | 37.72,27.81 U$3.GND17 | 37.72,27.81 42.93,27.81 | 42.93,27.81 45.87,27.81 46.11,28.06 | U1.5 41.51,34.69 41.4,34.57 40.9,34.57 40.54,34.93 40.54,36.32 | 32.67,6.27 32.68,6.28 | 45.82,23.16 42.93,26.05 42.93,27.81 | v43.43,7.78 43.43,10.21 42.76,10.88 41.68,10.88 | 3.53,35.03 3.53,35.93 U8.1 5.29,39.29 8.19,39.29 8.68,39.78 v9.68,39.78 13.43,39.78 U10.6 | 3.53,35.03 U8.7 | C14.2 C15.2 13.28,39.63 U10.6 | U$1.L2 18.34,8.28 21.3,8.28 22.43,9.41 22.43,12.04 | R1.1 22.18,11.58 22.18,12.04 | v13.68,24.53 13.38,24.83 C8.2 14.13,27.03 14.76,27.03 16.33,28.6 20.57,28.6 20.93,28.96 20.93,29.46 17.75,32.64 15.43,32.64 15.07,32.28 15.07,29.36 14.27,28.55 10.94,28.55 10.57,28.91 U9.THERMAL 3.6,29.54 2.74,29.54 2.6,29.67 2.6,30.36 2.93,30.69 v2.93,32.53 | v7.18,23.03 3.48,23.03 -(N)1.1 | -(N).1 6.62,16.22 v7.43,17.03 | 17.68,49.26 14.69,49.26 14.55,49.12 14.55,48.9 U10.20 | 17.68,49.26 19.43,49.26 19.56,49.12 19.56,47.44 16.43,44.31 U10.CP 16.43,43.28 13.93,40.78 U10.6 | v57.43,21.28 55.84,22.87 55.84,23.4 55.71,23.54 54.82,23.54 54.68,23.4 54.68,20.6 J1.2 | 52.17,39.02 53.92,39.02 54.32,39.42 56.93,39.42 57.29,39.78 57.29,40.28 56.54,41.03 56.54,41.64
  Top 0.152: 46.68,35.19 46.93,35.44 v46.93,36.28 | v17.68,49.78 17.68,49.26 | U7.5 30.66,54.28 v29.43,54.28 | 3.53,35.03 1.68,35.03 1.57,34.91 v1.57,33.27
  Top 0.254: C2.2 23.71,16.38 23.26,15.93 23.26,15.61 U6.2 22.86,13.78 | C3.2 21.07,24 21.07,21.72 C5.2 19.95,20.04 | C3.2 C4.2 16.75,23.72 14.49,23.72 v13.68,24.53 | U7.1 39.75,54.99 | 39.75,54.99 42.29,52.45 | 42.29,52.45 U7.20 | 39.75,54.99 38.35,53.59 33.66,53.59 33.66,53.6 U7.4 U7.5 28.71,55.39 27.94,54.61 27.94,52.56 U7.6 27.95,52.06 GND0.TP 25.4,57.15 GND_SOL.TP | U7.10 27.94,43.97 27.94,41.91 28.71,41.13 U7.11 32.58,41.96 32.58,42.63 33.15,43.2 44.45,43.2 | 52.07,36.85 52.69,36.85 52.85,37.01 52.85,38.35 52.17,39.02 48,43.2 44.45,43.2 | 52.07,36.85 51.45,36.85 51.29,37.01 51.29,37.88 48.04,41.13 U7.15 | 44.45,43.2 44.45,44.45 U7.16 41.86,45.28 41.19,45.28 41.03,45.44 41.03,51.08 42.29,52.34 42.29,52.45 | 19.95,20.04 21.3,18.69 22.3,18.69 22.46,18.53 22.46,17.03 21.18,15.75 21.18,13.78 22.86,13.78 | U$3.GND39 36.08,13.22 v35.56,12.7 U5.2 | v22.86,29.21 22.86,27.29 C3.2 | U$3.GND38 30.98,27.44 v30.48,27.94 | S1.2 28.33,25.79 v29.21,26.67 | U$3.GND18 36.51,29.53 v35.56,30.48 | 41.84,10.88 41.68,10.88 R9.2 38.76,11.49 38.76,12.97 37.85,13.88 U$3.GND28 | 52.07,36.85 52.03,36.81 48.91,36.81 47.97,35.86 47.97,35.18 | 56.54,41.64 56.54,42.18 54.61,44.11 v54.61,45.72 | 45.58,36.37 45.58,38.28 44.72,39.14 44.18,39.14 41.36,36.32 40.54,36.32 | U1.10 45.72,35.19 | 45.72,35.19 46.68,35.19 47.96,35.19 47.97,35.18 | U1.12 45.09,36.23 45.42,36.23 45.55,36.37 45.58,36.37 | 45.58,36.37 45.72,36.23 45.72,35.19 | U$3.GND3 48.89,20.29 48.69,20.29 45.82,23.16 | U$3.GND10 47.88,30.86 47.88,32.17 R3.1 47.97,35.18 | GND_N2.TP GND_N1.TP 54.61,15.24 J1.1 54.61,17.37 U$3.GND1 | 52.07,17.37 52.07,20.32 54.61,20.32 J1.2
  Top 0.254: CN2.1 18.18,17.61 18.18,17.98 19.95,19.75 19.95,20.04 | 22.18,12.04 22.43,12.04 22.61,12.04 23,12.43 23,12.97 22.86,13.11 22.86,13.78
  Top 0.305: J3.5 32.67,6.27 | v31.98,7.62 31.98,6.98 32.68,6.28
  Bottom 0.152: U3.6 52.88,15.78 54.26,15.78 U3.GND2 55.68,20.03 57.18,21.53 v57.43,21.28 | U3.GND1 46.76,7.53 43.43,7.53 v43.43,7.78 | C13.2 9.03,43.28 12.06,40.25 C10.2 | 5.93,24.42 5.93,22.78 | 5.93,22.78 SOLAR_GND.TP 6.68,16.28 v7.43,17.03 | 5.93,24.42 4.07,26.28 4.07,27.1 R19.1 | v7.18,23.03 6.93,23.03 6.68,22.78 5.93,22.78 | GND_3.TP 13.1,24.53 v13.68,24.53 | 5.93,24.42 7.07,23.28 7.07,21.53 7.43,21.17 7.93,21.17 10.09,23.33 10.09,30.41 6.81,33.69 3.28,33.69 3.1,33.51 3.1,32.7 v2.93,32.53 2.3,32.53 v1.57,33.27 | 45.11,32.78 46.93,34.6 v46.93,36.28 | v9.68,39.78 9.03,40.43 C6.2 C13.2 | J4.1 11.51,45.11 10.18,43.78 C13.2 | J2.1 16.93,51.47 16.93,49.78 v17.68,49.78 | J6.1 31.93,57.28 | 31.93,57.28 31.21,57.99 31.21,58 30.9,58.31 30.46,58.31 28.76,56.61 28.28,56.61 27.2,57.69 26.05,57.69 24.97,56.61 22.83,56.61 21.82,55.6 21.82,54.53 22.18,54.17 22.68,54.17 23.51,55 J5.1 | v29.43,54.28 29.43,54.78 31.93,57.28
  Bottom 0.254: GND_1.TP GND_2.TP GND_3.TP | C10.2 10.22,39.25 C12.2 | v22.86,29.21 24.13,29.21 | 24.13,29.21 C9.1 | 24.13,29.21 24.99,28.35 27.42,28.35 27.67,28.6 28.21,28.6 28.87,27.94 v30.48,27.94 v29.21,26.67 | U2.5 36.91,31.83 v35.56,30.48 | v31.98,7.62 35.56,11.2 v35.56,12.7 | v54.61,45.72 52.57,47.76 BT2.GND 42.64,52.84 | 45.11,32.78 45.11,30.21 44.72,29.82 44.18,29.82 43.79,30.21 43.79,38.75 40.64,41.91 38.06,41.91 R7.1
N$1
  Top 0.152: R1.2 18.64,9.57 18.43,9.78 17.81,9.78 LED2.C
N$2
  Top 0.152: D3.C 26.73,13.91 25.58,12.76 25.58,6.67 D1.C
  Top 0.254: U6.1 22.31,15.61 22.31,15.93 23.17,16.79 27.39,16.79 27.71,17.11 28.65,17.11 28.81,16.95 28.81,15.82 28.65,15.65 28.47,15.65 26.73,13.91 | U$1.L1 21.89,5.85 D1.C
N$3
  Top 0.152: C7.1 55.26,21.87 55.96,21.17 55.96,19.25 J1.3
N$4
  Top 0.152: 36.69,9.03 U5.5
  Top 0.254: R9.1 39.22,9.03 36.69,9.03
N$5
  Top 0.254: U6.3 23.81,9.84 21.59,7.62 20.32,7.62 20.18,7.47 U$1.COM
N$6
  Top 0.152: C7.2 50.8,19.7 50.8,18.67 50.7,18.57 U$3.RFC
N$7  (via drill 0.35)
  Top 0.254: v27.94,31.75 27.08,32.61 27.08,33.09 26.67,33.5 v26.67,34.29
  Bottom 0.254: 25.32,34.38 26.03,35.09 33.17,35.09 33.84,34.41 35.48,34.41 35.64,34.57 35.64,34.72 U2.3 | 25.32,34.38 D2.3 | C9.2 27.06,30.02 27.06,30.84 27.94,31.72 v27.94,31.75 | v26.67,34.29 26.59,34.38 25.32,34.38
N$8
  Top 0.254: U$3.PA32_SWDIO 41.97,13.57 41.97,13.37 46.46,8.89 SWDIO.TP
N$10
  Top 0.152: R15.2 7.51,32.03 3.93,32.03 3.62,31.72 U9.4 U9.5
N$11  (via drill 0.2, 0.35)
  Top 0.152: R2.1 10.68,20.67 9.91,21.44 9.91,24.96 8.24,26.64 7.43,26.64 7.32,26.53 v4.68,26.53 4.22,26.99 U9.8 | v9.18,30.03 8.87,30.34 R15.1
  Bottom 0.152: v4.68,26.53 6.32,26.53 7.43,25.42 7.93,25.42 8.29,25.78 8.29,30.14 8.68,30.53 v9.18,30.03
N$12
  Top 0.254: R8.1 30,9.51 LED1.A
N$13  (via drill 0.35)
  Top 0.254: LED1.C 30.75,11.16 31.75,10.16 v32.39,10.79 | v38.1,12.7 36.86,11.46 U5.1
  Bottom 0.254: v38.1,12.7 36.49,12.7 35.83,13.36 34.95,13.36 v32.39,10.79
N$14  (via drill 0.2)
  Top 0.152: U9.1 5.92,30.01 6.68,30.78 7.57,30.78 8.93,29.42 9.43,29.42 9.79,29.78 9.79,33.84 9.47,34.17 8.28,34.17 7.14,33.03 5.43,33.03 v5.43,32.78
  Bottom 0.152: v5.43,32.78 3.39,30.74 R19.2
N$15
  Top 0.254: U6.4 21.3,20.32 C5.1
N$16  (via drill 0.2)
  Top 0.152: U$3.UART3_RX 35.05,24.64 v36.83,22.86
  Bottom 0.152: v36.83,22.86 37.83,23.86 RX2.TP
N$19
  Top 0.254: R3.2 44.87,33.66 43.82,33.66 U1.7
N$20
  Top 0.152: 40.51,13.83 U$3.PA30_SWCLK
  Top 0.254: 40.51,13.83 40.77,13.57 40.77,13.37 45.72,8.42 SWCLK.TP
N$22
  Top 0.152: U8.5 7.23,36.43 R20.1
N$23  (via drill 0.35)
  Top 0.152: U$3.UART3_TX 36.39,25.84 v36.83,25.4
  Bottom 0.152: v36.83,25.4 TX2.TP
N$24
  Bottom 0.152: R13.2 13.66,33.95 D4.C
N$29
  Top 0.152: R21.2 13.03,29.28 12.36,29.95 12.36,36.33 9.78,38.91 5.79,38.91 3.61,36.73 U8.2
RGB_DIN
  Top 0.254: U$3.PA15 40.11,31.75 39.37,32.49 RGB_DIN/D9.TP
RST  (via drill 0.35)
  Top 0.152: v26.43,11.03 28.55,13.15 28.55,14.48 28.68,14.61 29.77,15.7 29.92,15.7 30.06,15.84 30.06,16.93 26.6,20.39 S1.1
  Top 0.254: U$3.RST 39.05,16.83 v38.1,17.78
  Bottom 0.152: 31.39,14.83 35.15,14.83 v38.1,17.78 | RST.TP 26.43,11.19 v26.43,11.03
  Bottom 0.254: RST.TP 27.94,14.59 28.9,15.55 30.68,15.55 31.39,14.83
RX1  (via drill 0.35)
  Top 0.254: R11.2 52.07,35.56 v50.8,34.29 | U$3.UART1_RX 43.85,16.16 44.58,16.89 v44.58,18.29
  Bottom 0.152: RX1.TP 52.18,28.78 50.8,28.78
  Bottom 0.254: v50.8,34.29 50.8,28.78 50.8,24.51 v44.58,18.29
RXLV
  Top 0.254: U7.14 38.28,41.96 38.28,42.63 38.44,42.79 46.96,42.79 R11.1
SCK  (via drill 0.2)
  Top 0.152: v39.18,20.28 35.93,20.28 35.43,19.78 34.47,19.78 U$3.PB23_SCK
  Bottom 0.152: v39.18,20.28 43.99,15.47 47.55,15.47 47.69,15.62 48.02,15.62 49.68,17.28 49.82,17.28 U3.5
SCL  (via drill 0.2, 0.35)
  Top 0.152: U$3.SCL 42.51,31.08 v42.67,31.24 | v41.15,35.18 v41.16,35.19 U1.4 | U8.4 5.13,36.08 5.43,35.78 5.72,35.78 v6.83,36.88 | v17.78,30.48 16.87,29.57 16.36,29.57 14.61,27.81 U9.10 | U10.9 17.68,37.78 | 17.68,37.78 17.68,35.78 v16.43,34.53 | v18.93,37.78 17.68,37.78 | v22.43,54.78 22.43,52.28 v22.06,51.91 24.31,49.66 v24.56,49.66
  Top 0.254: v38.1,31.74 34.48,35.36 34.48,35.37 33.66,36.19 U7.12
  Bottom 0.152: v42.67,31.24 41.28,32.64 41.28,35.05 v41.15,35.18 | v6.83,36.88 8.25,35.47 8.25,35.37 10.43,33.19 16.43,33.19 | 24.5,34.53 19.56,34.53 18.22,33.19 16.43,33.19 | v16.43,34.53 16.43,33.19 | SCL_3.TP 16.51,20.56 16.79,20.28 16.79,19.78 16.51,19.5 SCL_2.TP SCL_1.TP | J4.4 15.8,47.15 | 15.8,47.15 20.11,42.83 22.88,42.83 23.21,42.5 23.21,39.56 22.9,39.25 20.15,39.25 18.93,38.03 v18.93,37.78 | J2.4 20.53,53.02 20.53,52.03 | 15.8,47.15 16.23,47.15 20.53,51.45 20.53,52.03 | v22.06,51.91 20.66,51.91 20.53,52.03 | v22.43,54.78 22.43,55.78 22.95,56.3 25.1,56.3 26.18,57.39 27.07,57.39 28.41,56.05 J5.4 | J6.4 35.78,54.69 35.78,54.28 25.68,44.17 25.18,44.17 24.82,44.53 24.82,49.39 v24.56,49.66
  Bottom 0.254: SCL_3.TP 16.51,24.78 R17.1 17.13,29.83 v17.78,30.48 19.96,32.66 23.7,32.66 24.06,33.02 SCL.TP | v41.15,35.18 38.1,32.13 v38.1,31.74 38.1,34.95 42.03,38.88 42.03,39.61 41.51,40.12 37.67,40.12 37.06,40.73 37.06,42.65 36.9,42.82 35.54,42.82 28.22,35.5 25.19,35.5 24.5,34.81 24.5,34.53 24.5,33.77 24.66,33.61 29.89,33.61 SCL.TP | U2.8 33.74,33.02 SCL.TP
SDA  (via drill 0.2, 0.35)
  Top 0.152: U$3.SDA 41.31,31.66 43.31,33.66 U1.6 | 12.43,27.34 14.64,27.34 16.51,29.21 | 12.43,27.34 5.14,27.34 4.82,27.65 U9.9 | U8.3 5.63,38.03 6.43,38.03 v6.43,37.78 | v15.68,32.03 16.62,31.09 18.03,31.09 19.91,29.21 20.18,29.21 | 12.43,27.34 12.5,27.26 12.5,24.85 13.43,23.92 13.43,23.03 13.68,23.03 13.93,22.78 13.93,21.99 v13.45,21.51 | U10.10 19.71,40.28 21.07,38.92 | 27.46,41.81 27.28,41.63 27.28,37.85 26.92,37.49 22.5,37.49 21.07,38.92 | v22.68,42.28 21.07,40.67 21.07,38.92 | U7.9 26.26,46.36 26.18,46.28 26.18,44.53 | 26.18,44.53 26.18,43.09 27.59,41.69 | v25.43,44.78 25.93,44.78 26.18,44.53
  Top 0.254: 27.46,41.81 27.59,41.69 28.55,40.73 29.12,40.73 v31.75,38.1 27.94,34.29 27.94,32.68 28.6,32.02 28.6,31.48 27.94,30.82 v27.94,27.94 | 16.51,29.21 20.18,29.21 v20.32,29.21 | U1.6 43.2,34.46 42.95,34.22 40.71,34.22 38.1,36.83 v36.83,36.83
  Bottom 0.152: v6.43,37.78 6.43,37.35 6.22,37.13 6.22,36.63 11.32,31.53 15.43,31.53 15.68,31.78 v15.68,32.03 | SDA_2.TP 13.97,10.03 | SDA_3.TP 13.18,22.07 13.18,21.78 v13.45,21.51 | v22.68,42.28 22.68,42.53 19.01,42.53 J4.3 12.43,49.11 12.43,49.28 12.63,49.28 13.43,50.08 13.7,50.08 14.54,49.25 17.9,49.25 19.22,50.57 19.22,52.8 J2.3 18.93,53.3 18.93,53.78 19.3,53.78 19.83,54.31 20.32,54.31 20.85,53.78 26.41,53.78 27.09,54.46 27.09,55.01 J5.3 | J6.3 34.8,54.87 34.8,54.79 32.29,52.28 v25.18,52.28 25.18,45.28 25.43,45.03 v25.43,44.78
  Bottom 0.254: SDA_2.TP SDA_3.TP | U2.1 34.29,35.17 34.29,38.1 | 34.29,38.1 34.29,39.37 36.83,39.37 SDA.TP v36.83,36.83 | v31.75,38.1 34.29,38.1 | v27.94,27.94 21.59,27.94 v20.32,29.21 | R14.1 13.97,8.24 13.97,10.03 SDA_1.TP
TX1  (via drill 0.35)
  Top 0.152: U$3.UART1_TX 42.08,14.66 42.08,14.78 42.04,14.83 v42.04,18.29
  Top 0.254: R10.2 v49.53,34.29
  Bottom 0.152: TX1.TP 51.41,32.51 51.41,34.54 51.05,34.9 50.55,34.9 49.93,34.28 v49.53,34.28
  Bottom 0.254: v49.53,34.29 v49.53,34.28 49.53,25.78 v42.04,18.29
TXLV
  Top 0.254: R10.1 47.5,37.68 44.85,40.33 44.05,40.33 41.82,38.1 35.56,38.1 U7.13
V_BATT  (via drill 0.35)
  Top 0.152: +(P).1 3.83,19.49 +(P)1.1 | 6.26,18.66 7.28,17.64 7.68,17.64 8.04,17.28 8.04,16.78 7.93,16.67 7.93,15.78 8.43,15.28 13.18,15.28
  Top 0.254: v30.48,12.7 30.48,13.97 D3.A 29.09,14.37 30.41,15.69 30.41,18.13 26.88,21.67 25.04,21.67 24.88,21.51 24.88,19.27 26.64,17.52 28.81,17.52 29.3,17.03 29.43,17.03 29.48,16.98 C2.1 | U5.3 34.29,11.78 v34.29,13.97 | C8.1 11.43,26.23 11.43,24.78 12.85,23.36 12.85,22.34 12.45,21.94 12.45,16.17 CN2.2 13.18,15.28 13.18,13.79 12.46,13.07 12.46,12.61 13.3,11.77 13.6,11.77 15.14,13.31 21.73,13.31 v22.34,12.7 | +(P).1 6.26,18.66
  Bottom 0.254: v34.29,13.97 33.02,12.7 v30.48,12.7 28.06,10.28 24.76,10.28 v22.34,12.7
VDD_IO
  Top 0.152: U1.1 42.91,37.01 42.91,37.27 43.42,37.78 44.08,37.78 44.13,37.83 44.13,37.94 43.99,38.09 44.43,38.53

### Text on the board
tNames: RSL | D6 | D6 | A1 | A2 | iBUG V1.1 | A6 | D5